# Altium project 掌控拓展板Ⅰ V1.4.PrjPcb
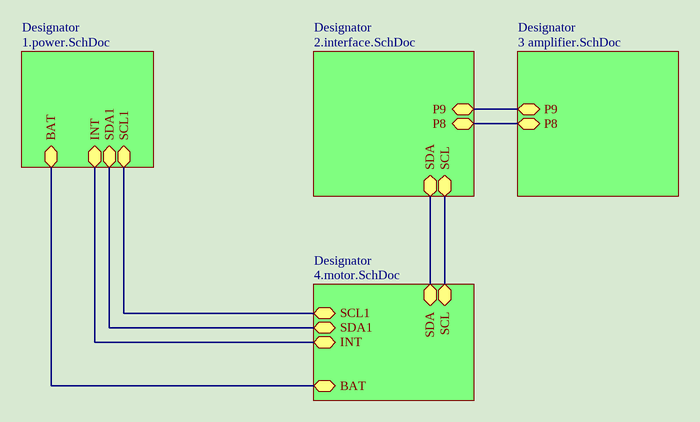
[diagram p0: mainsheet.SchDoc]
5 sheets, 105 parts. Net scope: hierarchical (ports join the sheet entries above them; power ports are global).
Board file: 掌控拓展板Ⅰ V1.4.PcbDoc
Sheets:
  mainsheet.SchDoc
    Designator = 1.power.SchDoc
    Designator = 2.interface.SchDoc
    Designator = 3 amplifier.SchDoc
    Designator = 4.motor.SchDoc

## Sheet mainsheet.SchDoc
size A4

### Sub-sheets
Designator = 1.power.SchDoc: SDA1 (bidir), SCL1 (bidir), INT (bidir), BAT (bidir)
Designator = 2.interface.SchDoc: P9 (bidir), P8 (bidir), SCL (bidir), SDA (bidir)
Designator = 3 amplifier.SchDoc: P9 (bidir), P8 (bidir)
Designator = 4.motor.SchDoc: SDA (bidir), SCL (bidir), SCL1 (bidir), SDA1 (bidir), INT (bidir), BAT (bidir)

### Nets
BAT: sheet Designator/BAT, sheet Designator/BAT
INT: sheet Designator/INT, sheet Designator/INT
P8: sheet Designator/P8, sheet Designator/P8
P9: sheet Designator/P9, sheet Designator/P9
SCL: sheet Designator/SCL, sheet Designator/SCL
SCL1: sheet Designator/SCL1, sheet Designator/SCL1
SDA: sheet Designator/SDA, sheet Designator/SDA
SDA1: sheet Designator/SDA1, sheet Designator/SDA1

## Sheet 1.power.SchDoc: 文档标题
size A4; DrawnBy: 创建者; Organization: Seneasy; DocumentNumber: 项目编号; Revision: 版本号; SheetNumber: 1; SheetTotal: 2; Time: 创建时间
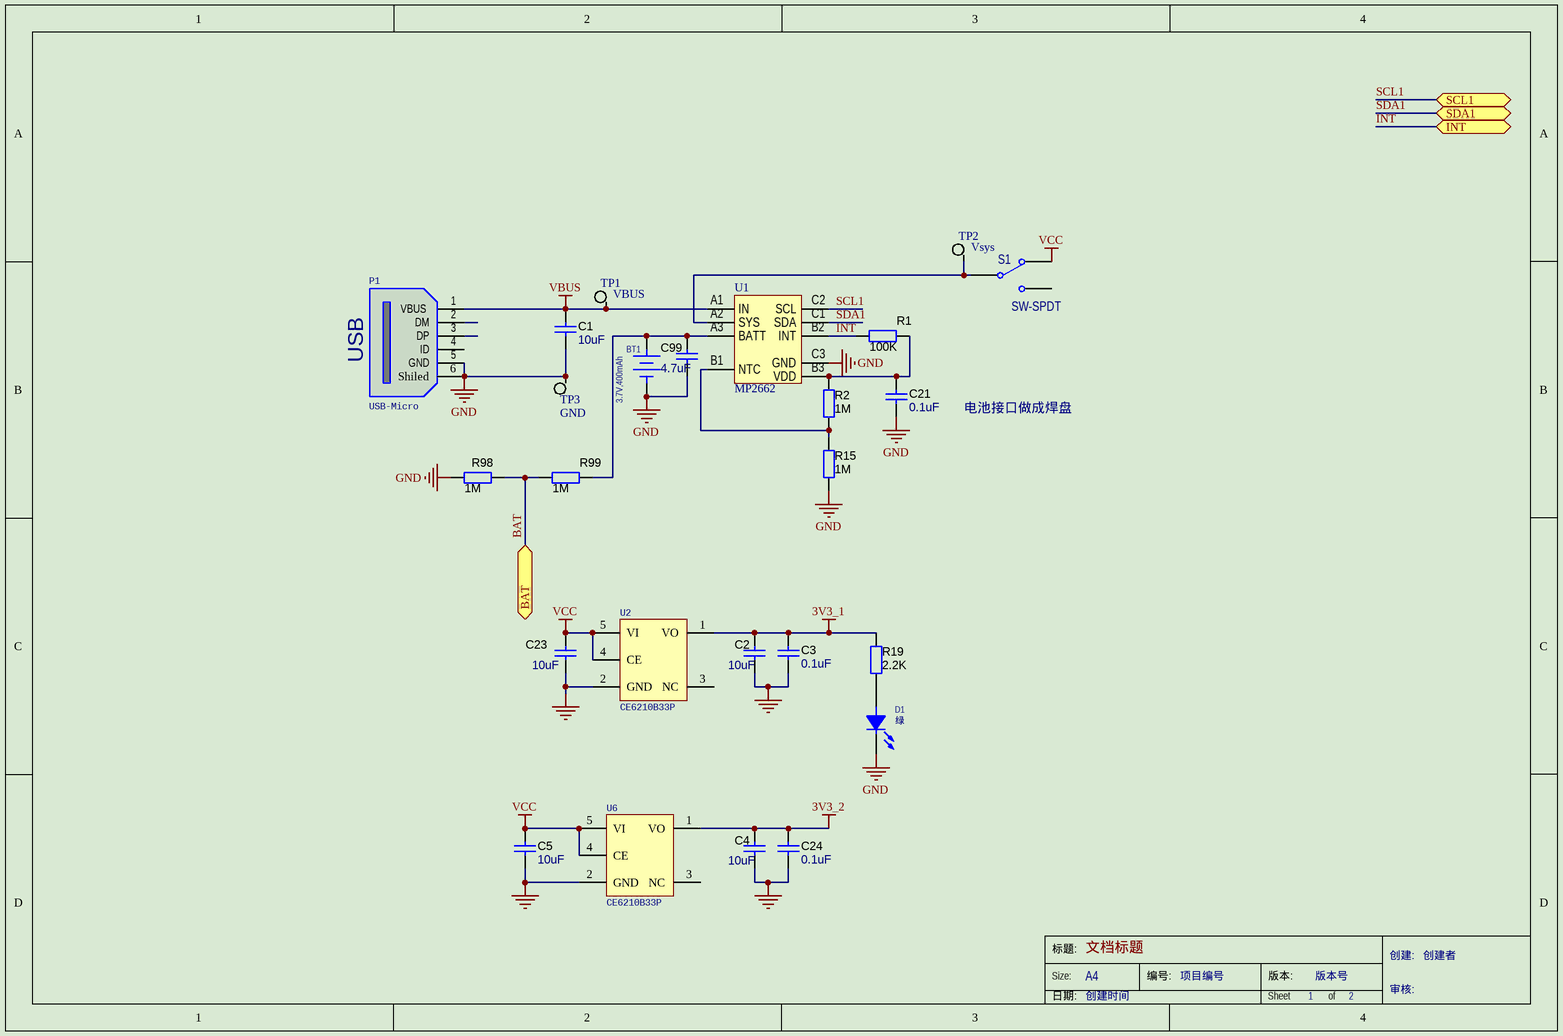
[diagram p1: 1.power.SchDoc]

### Parts
BT1  3.7V,400mAh  [2P/1.0MM立式贴片座子]
C1  10uF  [0603]
C2  10uF  [0603]
C3  0.1uF  [0402]
C4  10uF  [0603]
C5  10uF  [0603]
C21  0.1uF  [0603]
C23  10uF  [0603]
C24  0.1uF  [0402]
C99  4.7uF  [0603]
D1  绿  [0603LED]
P1  USB-Micro  [MICRO_USB2]
R1  100K  [0402]
R2  1M  [0402]
R15  1M  [0402]
R19  2.2K  [0402]
R98  1M  [0402]
R99  1M  [0402]
S1  SW-SPDT  [SW2]
TP1  VBUS  [测试点]
TP2  Vsys  [测试点]
TP3  GND  [测试点]
U1  MP2662  [WLCSP-9]
U2  CE6210B33P  [SOT89-5]
U6  CE6210B33P  [SOT89-5]

### Ports
BAT (bidir), INT (bidir), SCL1 (bidir), SDA1 (bidir)

### Nets
3V3_1: C2.1 C3.2 R19.1 U2.1(VO)
3V3_2: C4.1 C24.2 U6.1(VO)
GND: BT1.2(-) C1.2 C2.2 C3.1 C4.2 C5.2 C21.2 C23.2 C24.1 C99.2 D1.C(CATHODE) P1.5(GND) P1.6(Shiled) R15.2 R98.1 TP3.1 U1.C3(GND) U2.2(GND) U6.2(GND)
VBUS: C1.1 P1.1(VBUS) TP1.1 U1.A1(IN)
VCC: C5.1 C23.1 S1.3 U2.4(CE) U2.5(VI) U6.4(CE) U6.5(VI)
BAT: R98.2 R99.1 ; port BAT
INT: R1.1 U1.B2(INT) ; port INT
SCL1: U1.C2(SCL) ; port SCL1
SDA1: U1.C1(SDA) ; port SDA1
NetBT1_1: BT1.1(+) C99.1 R99.2 U1.A3(BATT)
NetC21_1: C21.1 R1.2 R2.1 U1.B3(VDD)
NetD1_A: D1.A(ANODE) R19.2
NetR2_2: R2.2 R15.1 U1.B1(NTC)
NetS1_2: S1.2 TP2.1 U1.A2(SYS)

Not connected (* = marked no-connect by the designer): P1 2(DM) 3(DP) 4(ID); S1 1; U2 3(NC); U6 3(NC)

### Notes on the sheet
- USB
- 电池接口做成焊盘
- 标题:
- Size:
- A4
- 编号:
- 版本:
- 创建:
- 日期:
- Sheet
- of
- 审核:

### Library data of the parts
BT1 = Battery: 4.2V Li-lon; Manufacturer: ?; PackageReference: ?; Value: ?; PartNumber: ?; ComponentLink1URL: ?
C1-C5 C21 C23 C24 C99 = CAP1_npol: CAP, CERM, 0.01uF, 100V, +/-5%, X7R, 0603; PartNumber: 06031C103JAT2A; Manufacturer: AVX; Polarized: N; Tolerance: 5; ESR_Ohm: 0.098; Voltage Rating DC: 25V; RoHS Compliant: Y; MountType: SMT; Dielectric: X7R; ComponentLink1URL: http://www.avx.com/docs/masterpubs/smccp.pdf; Operating Temperature: -55+125C; PackageReference: 0603
  C1 C2 C4 C5 C23: Value: 10uF
  C3 C21 C24: Value: 0.1uF
  C99: Value: 4.7uF
D1 = LED1: Manufacturer: ?; PackageReference: ?; PartNumber: ?; Value: ?
P1 = USB-Micro: USB Connector
R1 R2 R15 R19 R98 R99 = RES1: RES, 1.0k ohm, 5%, 0.1W, 0603; PartNumber: RC0603JR-071KL; Manufacturer: Yageo America; CompType: Resistor; Res_ohm: 1000; Value_Code: 1k00; Tolerance_%: 5; Power_W: 0.1; VDC_V: 50; TempCo: 100 ppm/C; EIA_Code: E24; U/M: EA; SymbolVersion: 2009-05-29; RoHS: Y; Value1: 5%; Value2: 0.1W; MountType: SMT; Technology: Thick Film; Published: 2008-06-26; Publisher: Texas Instruments; LatestRevisionDate: 2014-04-18; ComponentLink1Description: Datasheet link; ComponentLink1URL: http://www.yageo.com/pdf/Pu-RC0603_51_PbFree_L_2.pdf; Supplier Part Number 1: 311-1.0KGRCT-ND; Supplier 2: Mouser; Supplier Part Number 2: 603-RC0603JR-071KL; Supplier 3: Farnell; Supplier Part Number 3: 9233385; PackageReference: 0603
  R1: Value: 100K
  R2 R15 R98 R99: Value: 1M
  R19: Value: 2.2K
S1 = SW-SPDT: SPDT Subminiature Toggle Switch, Right Angle Mounting, Vertical Actuation; Published: 24-Mar-1999; LatestRevisionDate: 17-Dec-2003; LatestRevisionNote: Schematic revised, PCB Footprint replaced.; DatasheetVersion: 05-Dec-2000; PackageReference: TL36WW15050; Publisher: Altium Limited; PackageDescription: Switch; 4 Leads; ComponentLink1Description: Manufacturer Link; ComponentLink1URL: http://www.apem.com; 采购网址: http://www.cnhsdz.com/huansheng/products_content-437702.html
TP1-TP3 = TP: Test Point
U1 = MP2662: 500mA Single Cell Li-ion Battery Charger  with Power Path Management, 1mA  Termination and <1μA Battery Leakage
U2 U6 = AP2112K

## Sheet 2.interface.SchDoc: 文档标题
size A4; DrawnBy: 创建者; Organization: Seneasy; DocumentNumber: 项目编号; Revision: 版本号; SheetNumber: 1; SheetTotal: 2; PageSetup: Record=PageOptions|CenterHorizontal=True|CenterVertical=True|PrintScale=0.98|XCorrection=1.00|YCorrection=1.00|PrintKind=1|BorderSize=5000000|LeftOffset=0|BottomOffset=0|Orientation=2|PaperLength=2970|PaperWidth=2100|Scale=100|PaperSource=261|PrintQuality=-3|MediaType=1|DitherType=10|PrintScaleMode=1|PaperKind=A4 210 x 297 毫米¦PaperIndex=9; Time: 创建时间
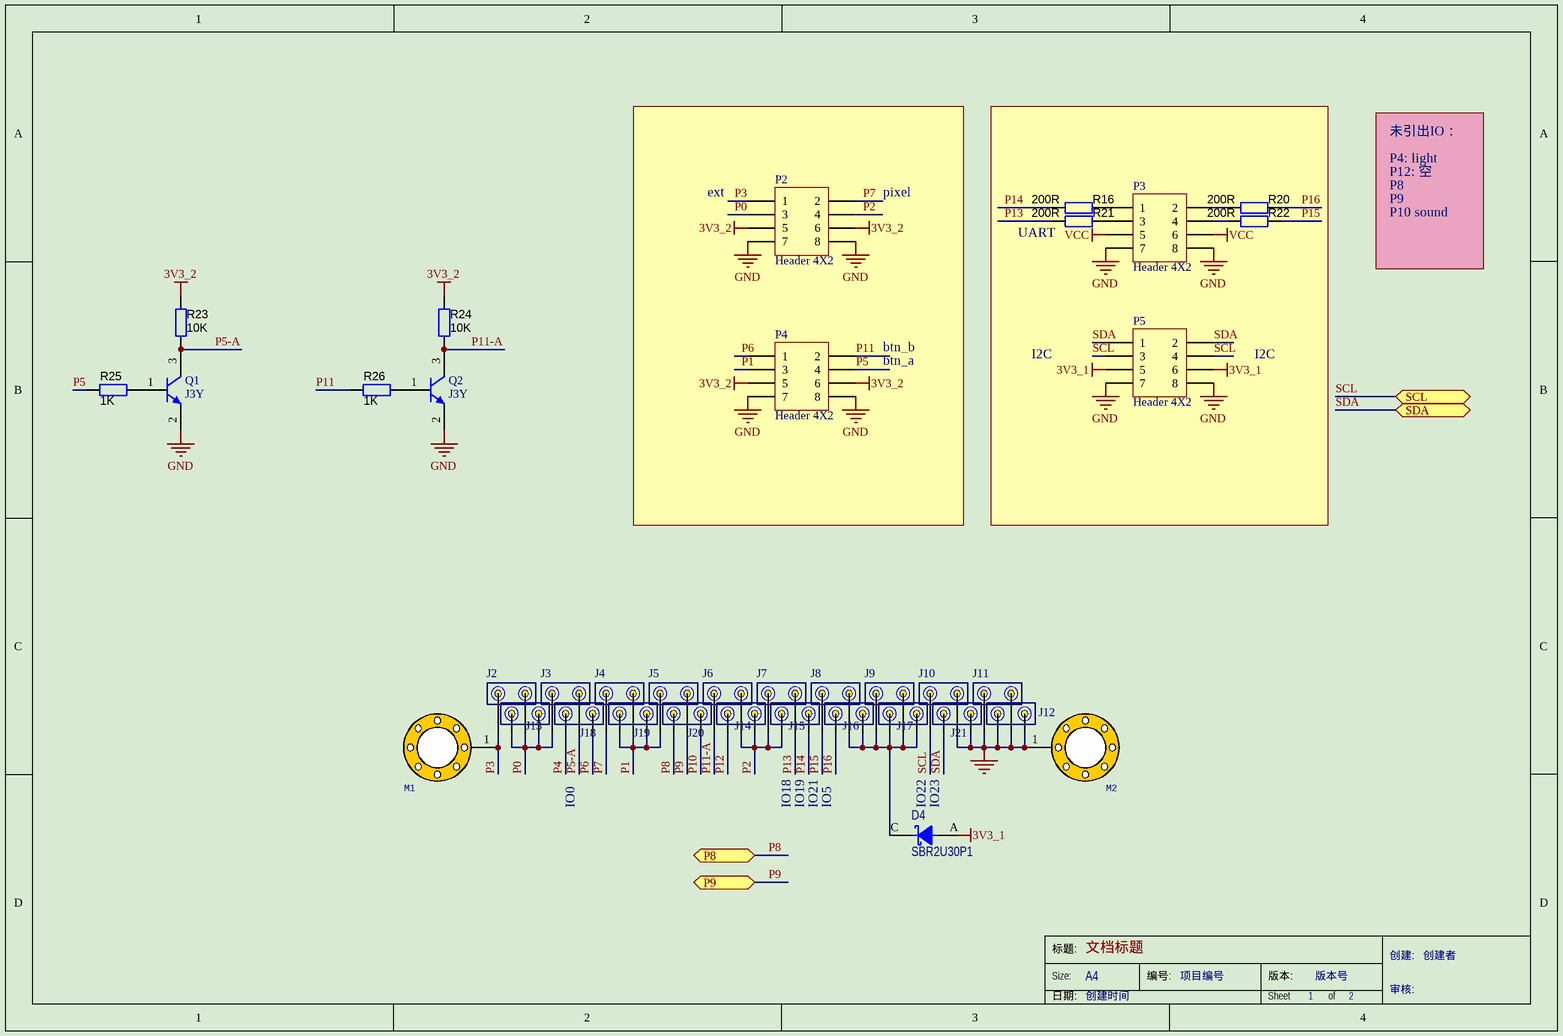
[diagram p2: 2.interface.SchDoc]

### Parts
D4  SBR2U30P1  [POWERDI123]
J2  (no value)  [顶针座子（2.54MM）]
J3  (no value)  [顶针座子（2.54MM）]
J4  (no value)  [顶针座子（2.54MM）]
J5  (no value)  [顶针座子（2.54MM）]
J6  (no value)  [顶针座子（2.54MM）]
J7  (no value)  [顶针座子（2.54MM）]
J8  (no value)  [顶针座子（2.54MM）]
J9  (no value)  [顶针座子（2.54MM）]
J10  (no value)  [顶针座子（2.54MM）]
J11  (no value)  [顶针座子（2.54MM）]
J12  (no value)  [顶针座子（2.54MM）]
J13  (no value)  [顶针座子（2.54MM）]
J14  (no value)  [顶针座子（2.54MM）]
J15  (no value)  [顶针座子（2.54MM）]
J16  (no value)  [顶针座子（2.54MM）]
J17  (no value)  [顶针座子（2.54MM）]
J18  (no value)  [顶针座子（2.54MM）]
J19  (no value)  [顶针座子（2.54MM）]
J20  (no value)  [顶针座子（2.54MM）]
J21  (no value)  [顶针座子（2.54MM）]
M1  (no value)  [3MM螺丝孔]
M2  (no value)  [3MM螺丝孔]
P2  Header 4X2  [HDR2X4]
P3  Header 4X2  [HDR2X4]
P4  Header 4X2  [HDR2X4]
P5  Header 4X2  [HDR2X4]
Q1  J3Y  [DFN 3L]
Q2  J3Y  [DFN 3L]
R16  200R  [0402]
R20  200R  [0402]
R21  200R  [0402]
R22  200R  [0402]
R23  10K  [0402]
R24  10K  [0402]
R25  1K  [0402]
R26  1K  [0402]

### Ports
P8 (bidir), P9 (bidir), SCL (bidir), SDA (bidir)

### Nets
3V3_1: D4.A(ANODE) P5.5 P5.6
3V3_2: P2.5 P2.6 P4.5 P4.6 R23.1 R24.1
GND: J10.2 J11.1 J11.2 J12.1 J12.2 J21.2 M2.1 P2.7 P2.8 P3.7 P3.8 P4.7 P4.8 P5.7 P5.8 Q1.2(E) Q2.2(E)
VCC: P3.5 P3.6
P0: J2.2 J3.1 J13.1 J13.2 P2.3
P1: J4.2 J5.1 J19.1 J19.2 P4.3
P2: J6.2 J7.1 J14.2 J15.1 P2.4
P3: J2.1 M1.1 P2.1
P4: J18.1
P5: P4.4 R25.1
P5-A: J3.2 Q1.3(C) R23.2
P6: J18.2 P4.1
P7: J4.1 P2.2
P8: J20.1 ; port P8
P9: J5.2 ; port P9
P10: J20.2
P11: P4.2 R26.1
P11-A: J6.1 Q2.3(C) R24.2
P12: J14.1
P13: J7.2 R21.1
P14: J15.2 R16.1
P15: J8.1 R22.2
P16: J16.1 R20.2
SCL: J10.1 P5.3 P5.4 ; port SCL
SDA: J21.1 P5.1 P5.2 ; port SDA
NetD4_C: D4.C(CATHODE) J8.2 J9.1 J9.2 J16.2 J17.1 J17.2
NetP3_1: P3.1 R16.2
NetP3_2: P3.2 R20.1
NetP3_3: P3.3 R21.2
NetP3_4: P3.4 R22.1
NetQ1_1: Q1.1(B) R25.2
NetQ2_1: Q2.1(B) R26.2

### Notes on the sheet
- 未引出IO：
- P4: light
- P12: 空
- (near P2) ext
- pixel
- UART
- P8
- P9
- P10 sound
- btn_a
- btn_b
- I2C
- IO0
- IO18
- IO19
- IO21
- IO5
- (near D4) IO22
- (near D4) IO23
- 标题:
- Size:
- A4
- 编号:
- 版本:
- 创建:
- 日期:
- Sheet
- of
- 审核:

### Library data of the parts
D4 = Diode_Schottky: Published: 8-Jun-2000; LatestRevisionDate: 17-Jul-2002; LatestRevisionNote: Re-released for DXP Platform.; PackageReference: SMB; Publisher: Altium Limited; PackageDescription: DO-214-AA/SMB; 2 C-Bend Leads; Body 5.3 x 3.6 mm, inc. leads (LxW); Code_JEDEC: DO-214-AA; Value: ?; PartNumber: ?; Manufacturer: ?
J2-J11 = pogopin
J12-J21 = pogopin_32
M1 M2 = screw
P2-P5 = Header 4X2: Header, 4-Pin, Dual row; LatestRevisionDate: 17-Jul-2002; LatestRevisionNote: Re-released for DXP Platform.; Publisher: Altium Limited
Q1 Q2 = 2N3904: NPN General Purpose Amplifier; Published: 8-Jun-2000; LatestRevisionDate: 15-Jan-2003; LatestRevisionNote: PCB Footprint 'BCY-W3/D4.7' replaced; DatasheetVersion: 1997; PackageVersion: Sep-1998; PackageReference: TO-92A; Publisher: Altium Limited; PackageDescription: TO, Flat Index; 3 In-Line, Axial Leads; Body Dia. 4.5mm; Leads 0.51 x 0.48 mm (max); ComponentLink1Description: Manufacturer Link; ComponentLink1URL: http://www.fairchildsemi.com/; ComponentLink2Description: Datasheet; ComponentLink2URL: http://www.fairchildsemi.com/ds/2N%2F2N3904.pdf
R16 R20-R26 = RES1: as R1 on sheet 1.power; SymbolVersion: 2009-05-29; RoHS: Y; Value1: 5%; Value2: 0.1W; MountType: SMT; Technology: Thick Film; Published: 2008-06-26; Publisher: Texas Instruments; LatestRevisionDate: 2014-04-18; ComponentLink1Description: Datasheet link; ComponentLink1URL: http://www.yageo.com/pdf/Pu-RC0603_51_PbFree_L_2.pdf; Supplier Part Number 1: 311-1.0KGRCT-ND; Supplier 2: Mouser; Supplier Part Number 2: 603-RC0603JR-071KL; Supplier 3: Farnell; Supplier Part Number 3: 9233385; PackageReference: 0603
  R16 R20-R22: Value: 200R
  R23 R24: Value: 10K
  R25 R26: Value: 1K

## Sheet 3 amplifier.SchDoc
size A4; PageSetup: Record=PageOptions|CenterHorizontal=True|CenterVertical=True|PrintScale=0.98|XCorrection=1.00|YCorrection=1.00|PrintKind=1|BorderSize=5000000|LeftOffset=0|BottomOffset=0|Orientation=2|PaperLength=2970|PaperWidth=2100|Scale=100|PaperSource=261|PrintQuality=-3|MediaType=1|DitherType=10|PrintScaleMode=1|PaperKind=A4 210 x 297 毫米¦PaperIndex=9
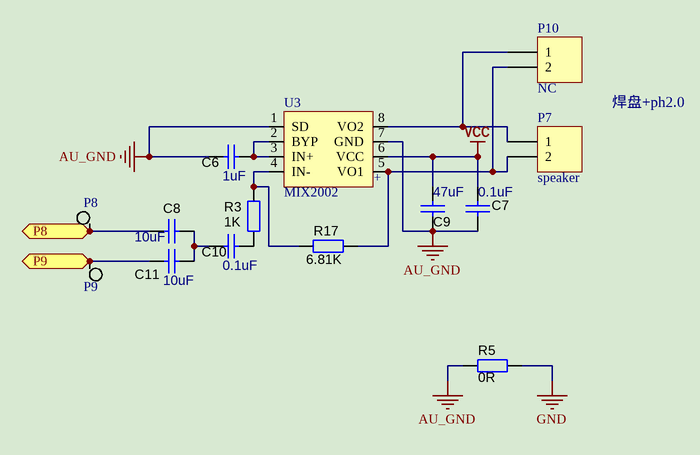
[diagram p3: 3 amplifier.SchDoc]

### Parts
C6  1uF  [0402]
C7  0.1uF  [0402]
C8  10uF  [0603]
C9  47uF  [0805]
C10  0.1uF  [0402]
C11  10uF  [0603]
P7  speaker  [焊盘]
P8  (no value)  [测试点]
P9  (no value)  [测试点]
P10  NC  [2PIN/2.0MM座子]
R3  1K  [0402]
R5  0R  [0402]
R17  6.81K  [0402]
U3  MIX2002  [SOP-8]

### Ports
P8 (bidir), P9 (bidir)

### Nets
AU_GND: C6.1 C7.2 C9.2 R5.2 U3.1(SD) U3.7(GND)
GND: R5.1
VCC: C7.1 C9.1 U3.6(VCC)
P8: C8.2 P8.1 ; port P8
P9: C11.2 P9.1 ; port P9
NetC6_2: C6.2 U3.2(BYP) U3.3(IN+)
NetC8_1: C8.1 C10.1 C11.1
NetC10_2: C10.2 R3.1
NetP7_1: P7.1 P10.1 U3.8(VO2)
NetP7_2: P7.2 P10.2 R17.2 U3.5(VO1)
NetR3_2: R3.2 R17.1 U3.4(IN-)

### Notes on the sheet
- 焊盘+ph2.0
- (near U3) +

### Library data of the parts
C6-C11 = CAP1_npol: as C1 on sheet 1.power; RoHS Compliant: Y; MountType: SMT; Dielectric: X7R; ComponentLink1URL: http://www.avx.com/docs/masterpubs/smccp.pdf; Operating Temperature: -55+125C; PackageReference: 0603
  C6: Value: 1uF
  C7 C10: Value: 0.1uF
  C8 C11: Value: 10uF
  C9: Value: 47uF
P7 P10 = Header 2: Header, 2-Pin; LatestRevisionDate: 17-Jul-2002; LatestRevisionNote: Re-released for DXP Platform.; Publisher: Altium Limited; 封装链接: https://item.taobao.com/item.htm?spm=a230r.1.14.27.3Tbh4z&id=540251210643&ns=1&abbucket=11#detail
P8 P9 = TP: Test Point
R3 R5 R17 = RES1: as R1 on sheet 1.power; SymbolVersion: 2009-05-29; RoHS: Y; Value1: 5%; Value2: 0.1W; MountType: SMT; Technology: Thick Film; Published: 2008-06-26; Publisher: Texas Instruments; LatestRevisionDate: 2014-04-18; ComponentLink1Description: Datasheet link; ComponentLink1URL: http://www.yageo.com/pdf/Pu-RC0603_51_PbFree_L_2.pdf; Supplier Part Number 1: 311-1.0KGRCT-ND; Supplier 2: Mouser; Supplier Part Number 2: 603-RC0603JR-071KL; Supplier 3: Farnell; Supplier Part Number 3: 9233385; PackageReference: 0603
  R3: Value: 1K
  R5: Value: 0R
  R17: Value: 6.81K
U3 = MIX2002: 名称: MIX2002

## Sheet 4.motor.SchDoc: 文档标题
size A4; DrawnBy: 创建者; Organization: Seneasy; DocumentNumber: 项目编号; Revision: 版本号; SheetNumber: 1; SheetTotal: 2; Time: 创建时间
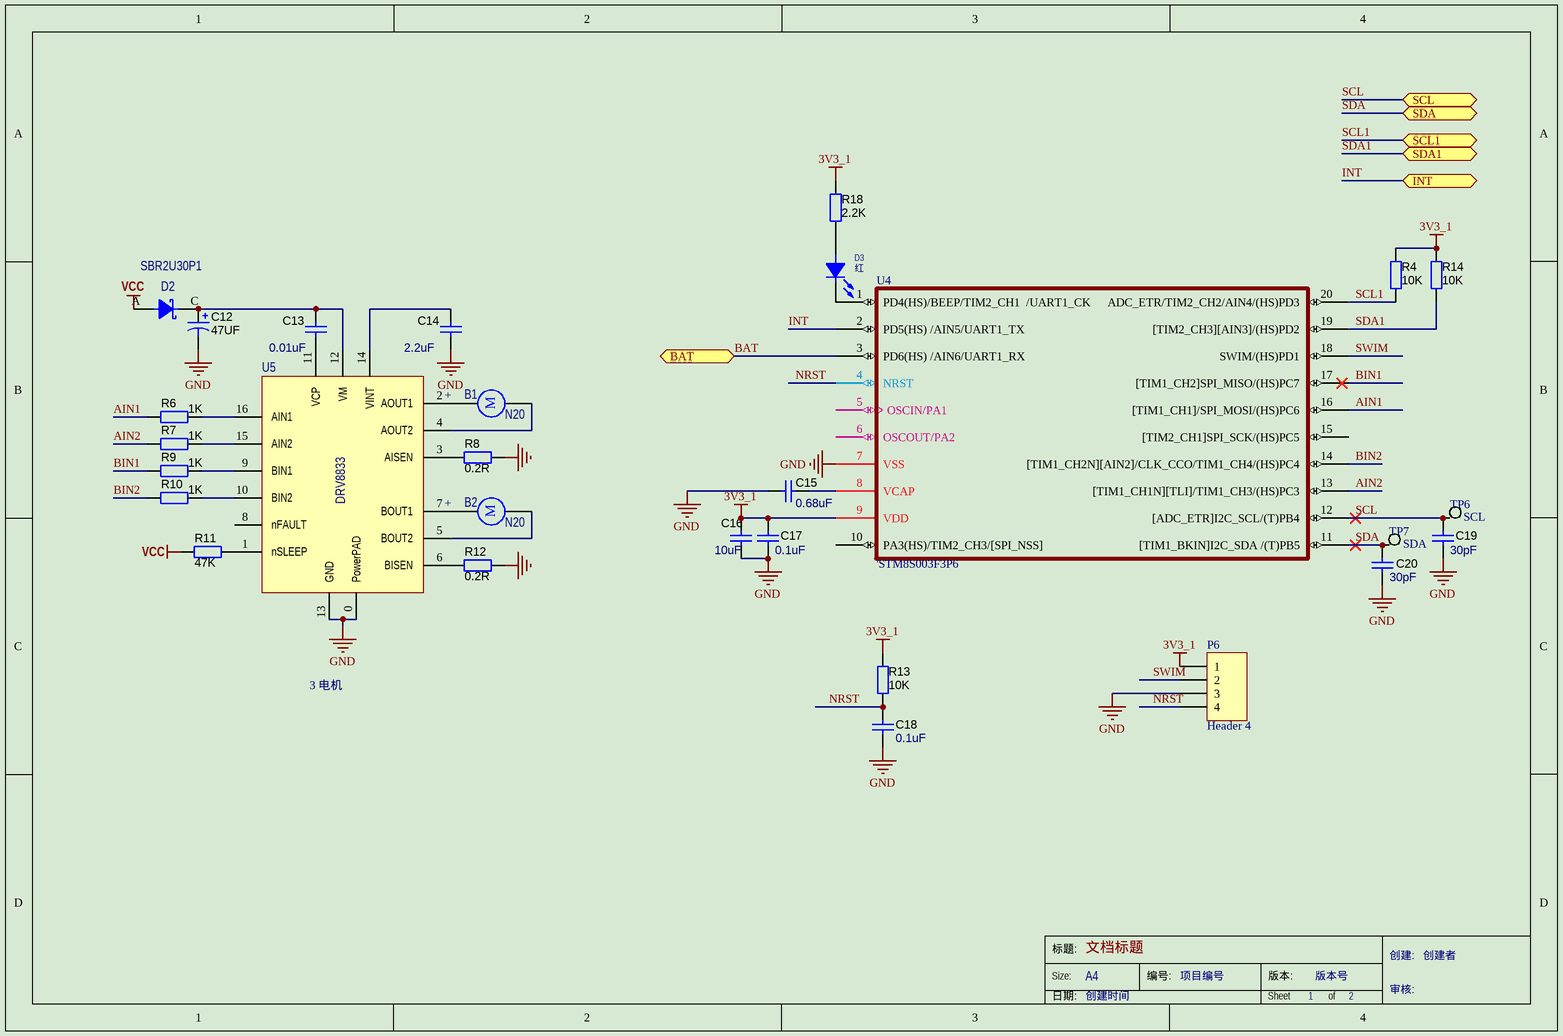
[diagram p4: 4.motor.SchDoc]

### Parts
B1  N20  [2PIN/2.54MM座子]
B2  N20  [2PIN/2.54MM座子]
C12  47UF  [0805]
C13  0.01uF  [0402]
C14  2.2uF  [0402]
C15  0.68uF  [0402]
C16  10uF  [0603]
C17  0.1uF  [0402]
C18  0.1uF  [0402]
C19  30pF  [0402]
C20  30pF  [0402]
D2  SBR2U30P1  [POWERDI123]
D3  红  [0603LED]
P6  Header 4  [排针2.54MM/4PIN]
R4  10K  [0402]
R6  1K  [0402]
R7  1K  [0402]
R8  0.2R  [0603]
R9  1K  [0402]
R10  1K  [0402]
R11  47K  [0402]
R12  0.2R  [0603]
R13  10K  [0402]
R14  10K  [0402]
R18  2.2K  [0402]
TP6  SCL  [测试点]
TP7  SDA  [测试点]
U4  'STM8S003F3P6  [UFQFPN20]
U5  DRV8833  [HTSSOP -16(PWP)]

### Ports
BAT (bidir), INT (bidir), SCL1 (bidir), SCL (bidir), SDA1 (bidir), SDA (bidir)

### Nets
3V3_1: C16.1 C17.2 P6.1 R4.2 R13.1 R14.2 R18.1 U4.9(VDD)
GND: C12.2(-) C14.1 C15.2 C16.2 C17.1 C18.1 C19.1 C20.1 P6.3 R8.2 R12.2 U4.7(VSS) U5.0(PowerPAD) U5.13(GND)
VCC: D2.A(ANODE) R11.1
AIN1: R6.1 U4.16([TIM1_CH1]/SPI_MOSI/(HS)PC6)
AIN2: R7.1 U4.13([TIM1_CH1N][TLI]/TIM1_CH3/(HS)PC3)
BAT: U4.3(PD6(HS)_/AIN6/UART1_RX) ; port BAT
BIN1: R9.1 U4.17([TIM1_CH2]SPI_MISO/(HS)PC7)
BIN2: R10.1 U4.14([TIM1_CH2N][AIN2]/CLK_CCO/TIM1_CH4/(HS)PC4)
INT: U4.2(PD5(HS)_/AIN5/UART1_TX) ; port INT
NRST: C18.2 P6.4 R13.2 U4.4(NRST)
SCL: C19.2 TP6.1 U4.12([ADC_ETR]I2C_SCL/(T)PB4) ; port SCL
SCL1: R4.1 U4.20(ADC_ETR/TIM2_CH2/AIN4/(HS)PD3) ; port SCL1
SDA: C20.2 TP7.1 U4.11([TIM1_BKIN]I2C_SDA_/(T)PB5) ; port SDA
SDA1: R14.1 U4.19([TIM2_CH3][AIN3]/(HS)PD2) ; port SDA1
SWIM: P6.2 U4.18(SWIM/(HS)PD1)
NetB1_1: B1.1 U5.2(AOUT1)
NetB1_2: B1.2 U5.4(AOUT2)
NetB2_1: B2.1 U5.7(BOUT1)
NetB2_2: B2.2 U5.5(BOUT2)
NetC12_1: C12.1(+) C13.2 D2.C(CATHODE) U5.12(VM)
NetC13_1: C13.1 U5.11(VCP)
NetC14_2: C14.2 U5.14(VINT)
NetC15_1: C15.1 U4.8(VCAP)
NetD3_A: D3.A(ANODE) R18.2
NetD3_C: D3.C(CATHODE) U4.1(PD4(HS)/BEEP/TIM2_CH1__/UART1_CK)
NetR6_2: R6.2 U5.16(AIN1)
NetR7_2: R7.2 U5.15(AIN2)
NetR8_1: R8.1 U5.3(AISEN)
NetR9_2: R9.2 U5.9(BIN1)
NetR10_2: R10.2 U5.10(BIN2)
NetR11_2: R11.2 U5.1(nSLEEP)
NetR12_1: R12.1 U5.6(BISEN)

Not connected (* = marked no-connect by the designer): U4 5(OSCIN/PA1) 6(OSCOUT/PA2) 10(PA3(HS)/TIM2_CH3/[SPI_NSS]) 15([TIM2_CH1]SPI_SCK/(HS)PC5); U5 8(nFAULT)

### Notes on the sheet
- +
- 3 电机
- 标题:
- Size:
- A4
- 编号:
- 版本:
- 创建:
- 日期:
- Sheet
- of
- 审核:
- (in symbol Motor) M

### Library data of the parts
B1 B2 = Motor: Motor, General Kind; Published: 24-Mar-1999; LatestRevisionDate: 17-Jul-2002; LatestRevisionNote: Re-released for DXP Platform.; PackageReference: RB5-10.5; Publisher: Altium Limited; PackageDescription: Capacitor (Radial); 2 Leads
C12 = CAP3_pol: CAP ALUM 22UF 10V 20% SMD; PartNumber: EEE-1AA220WR; Manufacturer: Panasonic - ECG; Polarized: Y; CompType: Capacitor; U/M: EA; Cap_F: 0.000022; Tolerance_%: 20; VDC_V: 10; IRMS_A: 0.03; TaMin_C: -40; TaMax_C: 105; Cap_Case: E55; SymbolVersion: 2008-07-09; Value: 47UF; RoHS: Y; Value1: ?; Value2: 10V; MountType: SMT; Technology: AL; Series: MVE; Published: 2008-06-19; Publisher: National Semiconductor; LatestRevisionDate: 2011-09-19; LatestRevisionNote: Removed DigiKeyPartNumber parameter.; ComponentLink1Description: Datasheet link; Alternate PartNumber: -; Alternate Manufacturer: -; Supplier Part Number 1: PCE3869CT-ND; PackageReference: 1206
C13-C20 = CAP1_npol: as C1 on sheet 1.power; RoHS Compliant: Y; MountType: SMT; Dielectric: X7R; ComponentLink1URL: http://www.avx.com/docs/masterpubs/smccp.pdf; Operating Temperature: -55+125C; PackageReference: 0603
  C13: Value: 0.01uF
  C14: Value: 2.2uF
  C15: Value: 0.68uF
  C16: Value: 10uF
  C17 C18: Value: 0.1uF
  C19 C20: Value: 30pF
D2 = Diode_Schottky: Published: 8-Jun-2000; LatestRevisionDate: 17-Jul-2002; LatestRevisionNote: Re-released for DXP Platform.; PackageReference: SMB; Publisher: Altium Limited; PackageDescription: DO-214-AA/SMB; 2 C-Bend Leads; Body 5.3 x 3.6 mm, inc. leads (LxW); Code_JEDEC: DO-214-AA; Value: ?; PartNumber: ?; Manufacturer: ?
D3 = LED1: Manufacturer: ?; PackageReference: ?; PartNumber: ?; Value: ?
P6 = Header 4: Header, 4-Pin; LatestRevisionDate: 17-Jul-2002; LatestRevisionNote: Re-released for DXP Platform.; Publisher: Altium Limited
R4 R6-R14 R18 = RES1: as R1 on sheet 1.power; SymbolVersion: 2009-05-29; RoHS: Y; Value1: 5%; Value2: 0.1W; MountType: SMT; Technology: Thick Film; Published: 2008-06-26; Publisher: Texas Instruments; LatestRevisionDate: 2014-04-18; ComponentLink1Description: Datasheet link; ComponentLink1URL: http://www.yageo.com/pdf/Pu-RC0603_51_PbFree_L_2.pdf; Supplier Part Number 1: 311-1.0KGRCT-ND; Supplier 2: Mouser; Supplier Part Number 2: 603-RC0603JR-071KL; Supplier 3: Farnell; Supplier Part Number 3: 9233385; PackageReference: 0603
  R4 R13 R14: Value: 10K
  R6 R7 R9 R10: Value: 1K
  R8 R12: Value: 0.2R
  R11: Value: 47K
  R18: Value: 2.2K
TP6 TP7 = TP: Test Point
U4 = STM8S103F2P6: ST 8-bit  Microcontroller
U5 = DRV8833PWP: DUAL H-BRIDGE MOTOR DRIVER

## Nets that join several sheets
3V3_1: 1.power (C2.1 C3.2 R19.1 U2.1), 2.interface (D4.A P5.5 P5.6), 4.motor (8 pins)
3V3_2: 1.power (C4.1 C24.2 U6.1), 2.interface (6 pins)
GND: 1.power (19 pins), 2.interface (17 pins), 3 amplifier (R5.1), 4.motor (14 pins)
VCC: 1.power (7 pins), 2.interface (P3.5 P3.6), 3 amplifier (C7.1 C9.1 U3.6), 4.motor (D2.A R11.1)
BAT: 1.power (R98.2 R99.1), 4.motor (U4.3)
INT: 1.power (R1.1 U1.B2), 4.motor (U4.2)
P8: 2.interface (J20.1), 3 amplifier (C8.2 P8.1)
P9: 2.interface (J5.2), 3 amplifier (C11.2 P9.1)
SCL: 2.interface (J10.1 P5.3 P5.4), 4.motor (C19.2 TP6.1 U4.12)
SCL1: 1.power (U1.C2), 4.motor (R4.1 U4.20)
SDA: 2.interface (J21.1 P5.1 P5.2), 4.motor (C20.2 TP7.1 U4.11)
SDA1: 1.power (U1.C1), 4.motor (R14.1 U4.19)